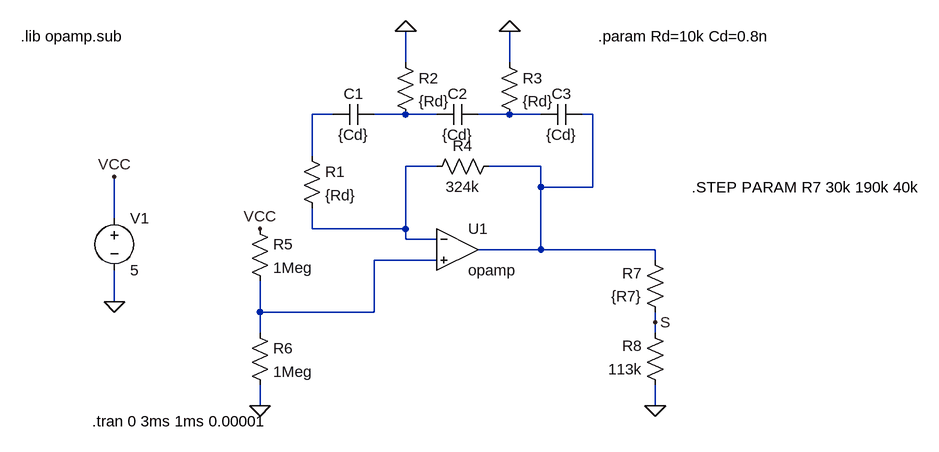
[diagram p0: schematic Freq_Oscil.asc]
Freq_Oscil.asc, the LTspice schematic file:
Version 4
SHEET 1 1188 680
WIRE 384 -144 384 -192
WIRE 544 -144 544 -192
WIRE 272 -64 240 -64
WIRE 384 -64 336 -64
WIRE 432 -64 384 -64
WIRE 544 -64 496 -64
WIRE 592 -64 544 -64
WIRE 672 -64 656 -64
WIRE 240 0 240 -64
WIRE 432 16 384 16
WIRE 592 16 512 16
WIRE 592 48 592 16
WIRE 672 48 672 -64
WIRE 672 48 592 48
WIRE -64 96 -64 32
WIRE 240 112 240 80
WIRE 384 112 384 16
WIRE 384 112 240 112
WIRE 384 128 384 112
WIRE 432 128 384 128
WIRE 592 144 592 48
WIRE 592 144 496 144
WIRE 768 144 592 144
WIRE 432 160 336 160
WIRE 768 160 768 144
WIRE -64 224 -64 176
WIRE 160 240 160 192
WIRE 336 240 336 160
WIRE 336 240 160 240
WIRE 768 256 768 240
WIRE 160 272 160 240
WIRE 768 272 768 256
WIRE 160 384 160 352
WIRE 768 384 768 352
FLAG -64 224 0
FLAG 768 384 0
FLAG 384 -192 0
FLAG 544 -192 0
FLAG 160 384 0
FLAG -64 32 VCC
FLAG 160 112 VCC
FLAG 768 256 S
SYMBOL voltage -64 80 R0
WINDOW 123 0 0 Left 0
WINDOW 39 0 0 Left 0
SYMATTR InstName V1
SYMATTR Value 5
SYMBOL res 144 96 R0
SYMATTR InstName R5
SYMATTR Value 1Meg
SYMBOL res 144 256 R0
SYMATTR InstName R6
SYMATTR Value 1Meg
SYMBOL res 528 0 R90
WINDOW 0 0 56 VBottom 2
WINDOW 3 32 56 VTop 2
SYMATTR InstName R4
SYMATTR Value 324k
SYMBOL res 784 256 R180
WINDOW 0 36 76 Left 2
WINDOW 3 36 40 Left 2
SYMATTR InstName R7
SYMATTR Value {R7}
SYMBOL res 784 368 R180
WINDOW 0 36 76 Left 2
WINDOW 3 36 40 Left 2
SYMATTR InstName R8
SYMATTR Value 113k
SYMBOL cap 496 -80 R90
WINDOW 0 0 32 VBottom 2
WINDOW 3 32 32 VTop 2
SYMATTR InstName C2
SYMATTR Value {Cd}
SYMBOL cap 336 -80 R90
WINDOW 0 0 32 VBottom 2
WINDOW 3 32 32 VTop 2
SYMATTR InstName C1
SYMATTR Value {Cd}
SYMBOL cap 656 -80 R90
WINDOW 0 0 32 VBottom 2
WINDOW 3 32 32 VTop 2
SYMATTR InstName C3
SYMATTR Value {Cd}
SYMBOL res 224 -16 R0
SYMATTR InstName R1
SYMATTR Value {Rd}
SYMBOL res 368 -160 R0
SYMATTR InstName R2
SYMATTR Value {Rd}
SYMBOL res 528 -160 R0
SYMATTR InstName R3
SYMATTR Value {Rd}
SYMBOL OpAmps\\opamp 464 80 R0
SYMATTR InstName U1
TEXT -98 408 Left 2 !.tran 0 3ms 1ms 0.00001
TEXT -208 -184 Left 2 !.lib opamp.sub
TEXT 680 -184 Left 2 !.param Rd=10k Cd=0.8n
TEXT 824 48 Left 2 !.STEP PARAM R7 30k 190k 40k

The netlist it stands for:
* Freq_Oscil.asc
V1 VCC 0 5
R5 VCC N006 1Meg
R6 N006 0 1Meg
R4 N004 N005 324k
R7 S N004 {R7}
R8 0 S 113k
C2 N003 N002 {Cd}
C1 N002 N001 {Cd}
C3 N004 N003 {Cd}
R1 N001 N005 {Rd}
R2 0 N002 {Rd}
R3 0 N003 {Rd}
XU1 N005 N006 N004 opamp Aol=100K GBW=10Meg  ; pins invin noninvin out
.tran 0 3ms 1ms 0.00001
.lib opamp.sub
.param Rd=10k Cd=0.8n
.STEP PARAM R7 30k 190k 40k
.backanno
.end